# Altium schematic sheet Smartfin Main PCBA Control.SchDoc: Control
size Tabloid; TOCFontName: Consolas; TOCFontSize: 24; TOCFontColor: 0; TOCFontAttributes: 0; TOCMaxLinesInTable: 25; TOCVerticalOffset: 200; TOCHorizontalOffset: 500; TOCHorizontalSeparation: 800; TOCVerticalSeparation: 30; TOCHorizTableSize: 640; Engineer: Amy Domino; DocumentNumber: 644-001-023; Revision: A; SheetNumber: 6; SheetTotal: 9; PageSetup: Record=PageOptions|CenterHorizontal=True|CenterVertical=True|PrintScale=0.96|XCorrection=1.00|YCorrection=1.00|PrintKind=0|BorderSize=5000000|LeftOffset=0|BottomOffset=0|Orientation=2|PaperLength=1000|PaperWidth=1000|Scale=100|PaperSource=7|PrintQuality=-4|MediaType=1|DitherType=10|PaperKind=11" x 17"|PrintScaleMode=1
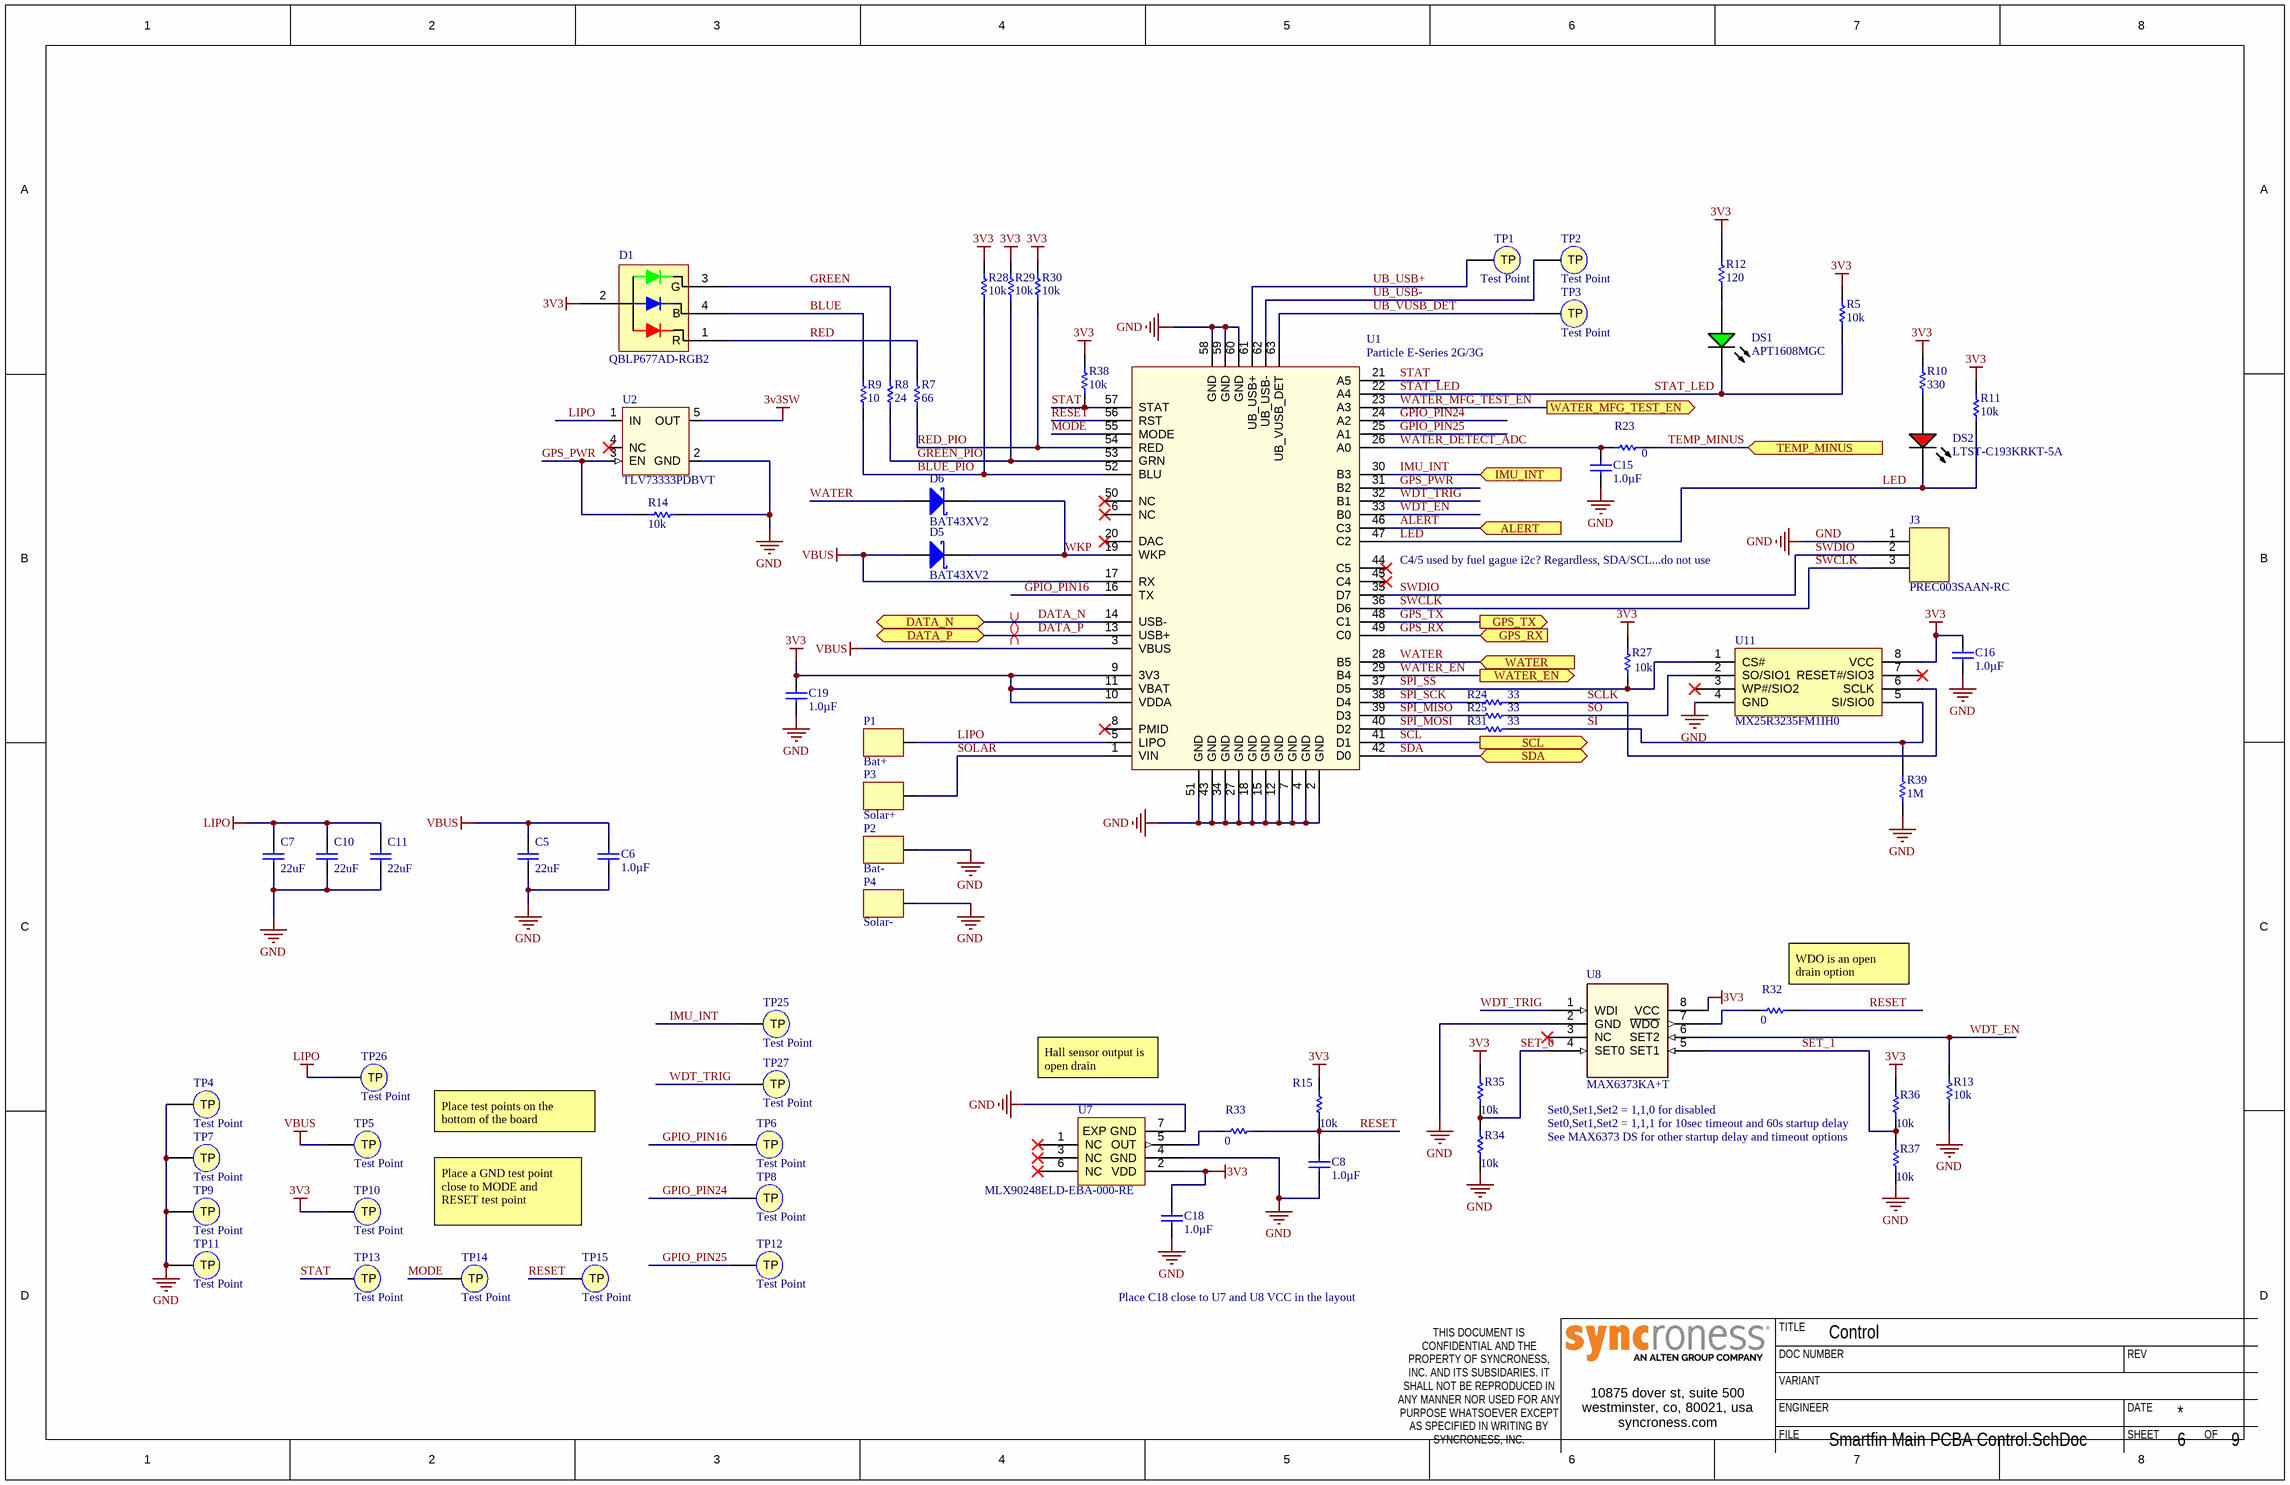
[diagram p0: Smartfin Main PCBA Control.SchDoc]

## Parts
C5  22uF  [CAPC0603(1608)100_N]
C6  1.0µF  [CAPC0402(1005)60_N]
C7  22uF  [CAPC0603(1608)100_N]
C8  1.0µF  [CAPC0402(1005)60_N]
C10  22uF  [CAPC0603(1608)100_N]
C11  22uF  [CAPC0603(1608)100_N]
C15  1.0µF  [CAPC0402(1005)60_N]
C16  1.0µF  [CAPC0402(1005)60_N]
C18  1.0µF  [CAPC0402(1005)60_N]
C19  1.0µF  [CAPC0402(1005)60_N]
D1  QBLP677AD-RGB2  [QBLP677AD-RGB2-Footprint-1]
D5  BAT43XV2  [SOD-523F]
D6  BAT43XV2  [SOD-523F]
DS1  APT1608MGC  [LED1608X08N]
DS2  LTST-C193KRKT-5A  [LTST-C193KRKT-5A_V]
J3  PREC003SAAN-RC  [HDR_Single_100mil_3D_3]
P1  Bat+  [Battery Pad-Footprint-1]  (no BOM)
P2  Bat-  [Battery Pad-Footprint-1]  (no BOM)
P3  Solar+  [Battery Pad-Footprint-1]  (no BOM)
P4  Solar-  [Battery Pad-Footprint-1]  (no BOM)
R5  10k  [RESC0402(1005)_N]
R7  66  [RESC1005X40X25LL05T10]
R8  24  [RESC1005X40X25ML10T10]
R9  10  [RESC1005X40X25ML05T10]
R10  330  [RESC1005X04N]
R11  10k  [RESC0402(1005)_N]
R12  120  [RESC1005X04N]
R13  10k  [RESC0402(1005)_N]
R14  10k  [RESC0402(1005)_N]
R15  10k  [RESC0402(1005)_N]
R23  0  [RESC0402(1005)_N]
R24  33  [RESC1005X04N]
R25  33  [RESC1005X04N]
R27  10k  [RESC0402(1005)_N]
R28  10k  [RESC0402(1005)_N]
R29  10k  [RESC0402(1005)_N]
R30  10k  [RESC0402(1005)_N]
R31  33  [RESC1005X04N]
R32  0  [RESC0402(1005)_N]
R33  0  [RESC0402(1005)_N]
R34  10k  [RESC0402(1005)_N]
R35  10k  [RESC0402(1005)_N]
R36  10k  [RESC0402(1005)_N]
R37  10k  [RESC0402(1005)_N]
R38  10k  [RESC0402(1005)_N]
R39  1M  [RESC0402(1005)_N]
TP1  Test Point  [TESTPAD_ICT]  (no BOM)
TP2  Test Point  [TESTPAD_ICT]  (no BOM)
TP3  Test Point  [TESTPAD_ICT]  (no BOM)
TP4  Test Point  [TESTPAD_ICT]  (no BOM)
TP5  Test Point  [TESTPAD_ICT]  (no BOM)
TP6  Test Point  [TESTPAD_ICT]  (no BOM)
TP7  Test Point  [TESTPAD_ICT]  (no BOM)
TP8  Test Point  [TESTPAD_ICT]  (no BOM)
TP9  Test Point  [TESTPAD_ICT]  (no BOM)
TP10  Test Point  [TESTPAD_ICT]  (no BOM)
TP11  Test Point  [TESTPAD_ICT]  (no BOM)
TP12  Test Point  [TESTPAD_ICT]  (no BOM)
TP13  Test Point  [TESTPAD_ICT]  (no BOM)
TP14  Test Point  [TESTPAD_ICT]  (no BOM)
TP15  Test Point  [TESTPAD_ICT]  (no BOM)
TP25  Test Point  [TESTPAD_ICT]  (no BOM)
TP26  Test Point  [TESTPAD_ICT]  (no BOM)
TP27  Test Point  [TESTPAD_ICT]  (no BOM)
U1  Particle E-Series 2G/3G  [Particle E-Series-Footprint-1]
U2  TLV73333PDBVT  [TLV73333PDBVR-Footprint-1]
U7  MLX90248ELD-EBA-000-RE  [MLX90248ELD-EBA-000-RE-Footprint-1]
U8  MAX6373KA+T  [MAX6373KA+T-Footprint-1]
U11  MX25R3235FM1IH0  [SOP127P600X175-8N]

## Ports
ALERT (in), DATA_N (bidir), DATA_P (bidir), GPS_RX (in), GPS_TX (out), IMU_INT (in), SCL (out), SDA (bidir), TEMP_MINUS (in), WATER (in), WATER_EN (out), WATER_MFG_TEST_EN (out)

## Nets
3V3: C16.2 C18.2 C19.2 D1.2(A) R5.2 R10.2 R11.2 R12.2 R15.2 R27.2 R28.2 R29.2 R30.2 R35.2 R36.2 R38.2 TP10.1(TP) U1.9(3V3) U1.10(VDDA) U1.11(VBAT) U7.2(VDD) U8.8(VCC) U11.8(VCC)
3v3SW: U2.5(OUT)
GND: C5.1 C6.1 C7.1 C8.1 C10.1 C11.1 C15.1 C16.1 C18.1 C19.1 J3.1 P2.1 P4.1 R13.1 R14.1 R34.1 R37.1 R39.1 TP4.1(TP) TP7.1(TP) TP9.1(TP) TP11.1(TP) U1.2(GND) U1.4(GND) U1.7(GND) U1.12(GND) U1.15(GND) U1.18(GND) U1.27(GND) U1.34(GND) U1.43(GND) U1.51(GND) U1.58(GND) U1.59(GND) U1.60(GND) U2.2(GND) U7.4(GND) U7.7(EXP_GND) U8.2(GND) U11.4(GND)
LIPO: C7.2 C10.2 C11.2 P1.1 TP26.1(TP) U1.5(LIPO) U2.1(IN)
VBUS: C5.2 C6.2 D5.A TP5.1(TP) U1.3(VBUS) U1.17(RX)
ALERT: U1.46(C3) ; port ALERT
BLUE: D1.4(B) R9.2
BLUE_PIO: R9.1 R28.1 U1.52(BLU)
DATA_N: U1.14(USB-) ; port DATA_N
DATA_P: U1.13(USB+) ; port DATA_P
GPIO_PIN16: TP6.1(TP) U1.16(TX)
GPIO_PIN24: TP8.1(TP) U1.24(A2)
GPIO_PIN25: TP12.1(TP) U1.25(A1)
GPS_PWR: R14.2 U1.31(B2) U2.3(EN)
GPS_RX: U1.49(C0) ; port GPS_RX
GPS_TX: U1.48(C1) ; port GPS_TX
GREEN: D1.3(G) R8.2
GREEN_PIO: R8.1 R29.1 U1.53(GRN)
IMU_INT: TP25.1(TP) U1.30(B3) ; port IMU_INT
LED: DS2.2(K) R11.1 U1.47(C2)
MODE: TP14.1(TP) U1.55(MODE)
RED: D1.1(R) R7.2
RED_PIO: R7.1 R30.1 U1.54(RED)
RESET: C8.2 R15.1 R32.2 R33.2 TP15.1(TP) U1.56(RST)
SCL: U1.41(D1) ; port SCL
SCLK: R24.2 U11.6(SCLK)
SDA: U1.42(D0) ; port SDA
SET_0: R34.2 R35.1 U8.4(SET0)
SET_1: R36.1 R37.2 U8.5(SET1)
SI: R31.2 R39.2 U11.5(SI/SIO0)
SO: R25.2 U11.2(SO/SIO1)
SOLAR: P3.1 U1.1(VIN)
SPI_MISO: R25.1 U1.39(D3)
SPI_MOSI: R31.1 U1.40(D2)
SPI_SCK: R24.1 U1.38(D4)
SPI_SS: R27.1 U1.37(D5) U11.1(CS#)
STAT: R38.1 TP13.1(TP) U1.21(A5) U1.57(STAT)
STAT_LED: DS1.K R5.1 U1.22(A4)
SWCLK: J3.3 U1.36(D6)
SWDIO: J3.2 U1.35(D7)
TEMP_MINUS: R23.2 ; port TEMP_MINUS
UB_USB+: TP1.1(TP) U1.61(UB_USB+)
UB_USB-: TP2.1(TP) U1.62(UB_USB-)
UB_VUSB_DET: TP3.1(TP) U1.63(UB_VUSB_DET)
WATER: D6.A U1.28(B5) ; port WATER
WATER_DETECT_ADC: C15.2 R23.1 U1.26(A0)
WATER_EN: U1.29(B4) ; port WATER_EN
WATER_MFG_TEST_EN: U1.23(A3) ; port WATER_MFG_TEST_EN
WDT_EN: R13.2 U1.33(B0) U8.6(SET2)
WDT_TRIG: TP27.1(TP) U1.32(B1) U8.1(WDI)
WKP: D5.K D6.K U1.19(WKP)
NetDS1_A: DS1.A R12.1
NetDS2_1: DS2.1(A) R10.1
NetR32_1: R32.1 U8.7(~{WDO})
NetR33_1: R33.1 U7.5(OUT)

Not connected (* = marked no-connect by the designer): U1 6(NC)* 8(PMID)* 20(DAC)* 44(C5)* 45(C4)* 50(NC)*; U2 4(NC)*; U7 1(NC)* 3(NC)* 6(NC)*; U8 3(NC)*; U11 3(WP#/SIO2)* 7(RESET#/SIO3)*

## Layout directives
differential pair: DATA_N, DATA_P

## Notes on the sheet
- (near U1) C4/5 used by fuel gague i2c? Regardless, SDA/SCL...do not use
- (near R32) WDO is an open drain option
- Hall sensor output is open drain
- Place test points on the bottom of the board
- Set0,Set1,Set2 = 1,1,0 for disabled
- (near R37) See MAX6373 DS for other startup delay and timeout options
- (near R36) Set0,Set1,Set2 = 1,1,1 for 10sec timeout and 60s startup delay
- Place a GND test point close to MODE and RESET test point
- Place C18 close to U7 and U8 VCC in the layout
- TITLE
- DOC NUMBER
- VARIANT
- REV
- 10875 dover st, suite 500
  westminster, co, 80021, usa
  syncroness.com
- FILE
- ENGINEER
- SHEET
- DATE
- OF
- THIS DOCUMENT IS CONFIDENTIAL AND THE PROPERTY OF SYNCRONESS, INC. AND ITS SUBSIDARIES. IT SHALL NOT BE REPRODUCED IN ANY MANNER NOR USED FOR ANY PURPOSE WHATSOEVER EXCEPT AS SPECIFIED IN WRITING BY SYNCRONESS, INC.

## Library data of the parts
C5 C7 C10 C11 = CMP-23693-A.2: CAP CER 22UF 10V X5R 0603; Manufacturer: Murata Electronics; Manufacturer Part Number: GRM188R61A226ME15D; Tolerance: 20%; Case/Package: 0603; Case Code (Metric): 1608; Case Code (Imperial): 0603; Capacitance: 22uF; Voltage Rating: 10V; Dielectric: X5R; Height: 1mm; Width: 0.8mm; Manufacturer 2: Samsung Electro-Mechanics; Manufacturer 3: TDK Corporation; Manufacturer Part Number 2: CL10A226MPCNUBE; Manufacturer Part Number 3: C1608X5R1A226M080AC; Operating Temperature: -55°C ~ 85°C; Supplier 1: Digi-Key; Supplier 2: Digi-Key; Supplier 3: Digi-Key; Supplier Part Number 1: 490-10476-1-ND; Supplier Part Number 2: 1276-6504-1-ND; Supplier Part Number 3: 445-9077-1-ND
C6 C8 C15 C16 C18 C19 = CMP-13694-A.6: CAP CER 1UF 10V 10% X5R 0402; Manufacturer: Yageo; Manufacturer Part Number: CC0402KRX5R6BB105; Manufacturer 2: Samsung Electro-Mechanics; Manufacturer 3: AVX Corporation; Manufacturer Part Number 2: CL05A105KP5NNNC; Manufacturer Part Number 3: 0402ZD105KAT2A; Operating Temperature: -55°C ~ 85°C; Supplier Part Number 1: 311-1439-1-ND; Supplier Part Number 2: 1276-1076-1-ND; Supplier Part Number 3: 478-4596-1-ND; Temperature Coefficient: X5R; Tolerance: ±10%; Capacitance: 1.0µF; Voltage - Rated: 10V; Supplier 2: Digi-Key; Supplier 3: Digi-Key; Supplier 1: Digi-Key; Datasheet: http://www.samsungsem.com/kr/support/product-search/mlcc/__icsFiles/afieldfile/2019/05/10/19-CL05A105KP5NNNC.pdf
D1 = CMP-23886-A.1: LED RGB, 3528 PLCC4 DOME LENS, 2; Manufacturer: QT Brightek (QTB); Color: Blue,Green,Red; Lens Style: Round,Dome; Element Configuration: Common Anode; Lens Transparency: Diffused; Test Current: 20mA; Viewing Angle: 30°; Lens Size: 2.40mm; Mount: Surface Mount; Case/Package: SMD/SMT; Length: 3.20mm; Height: 3.30mm; Width: 2.7mm; Manufacturer Part Number: QBLP677AD-RGB2; Supplier: Digi-Key; Supplier Part Number: 1516-QBLP677AD-RGB2CT-ND
D5 D6 = CMP-23830-A.2: DIODE SCHOTTKY 30V 200MA SOD523F; Manufacturer: ON Semiconductor; Max Surge Current: 4A; Max Power Dissipation: 200mW; Recovery Time: 5ns; Forward Voltage: 1V; Max Reverse Leakage Current: 500nA; Peak Reverse Current: 10mA; Element Configuration: Single; Manufacturer Part Number: BAT43XV2; Packaging: Tape and Reel; Mount: Surface Mount; Number of Pins: 2; Weight: 0.01g; Contact Plating: Tin,Matte; Min Operating Temperature: -65°C; Max Operating Temperature: 125°C; Package Quantity: 1; Forward Current: 200mA; Average Rectified Current: 200mA; Reverse Recovery Time: 5ns; Max Repetitive Reverse Voltage (Vrrm): 30V; Peak Non-Repetitive Surge Current: 4A; Max Forward Surge Current (Ifsm): 200mA; Max Reverse Voltage (DC): 30V; Length: 1.3mm; Height: 0.7mm; Width: 0.9mm; Radiation Hardening: No; Supplier: Digi-Key; Supplier Part Number: BAT43XV2CT-ND
DS1 = CMP-08086-A.3: LED 1.6X0.8MM 570NM GRN CLR SMD; Manufacturer: Kingbright; Color: Green; Current - Test: 20mA; Lens Style/Size: Rectangle with Flat Top, 1.2mm x 0.8mm; Lens Type: Clear; Millicandela Rating: 70mcd; Viewing Angle: 120°; Voltage - Forward (Vf) (Typ): 2.1V; Wavelength - Peak: 574nm; Manufacturer Part Number: APT1608MGC; ComponentLink1URL: http://www.kingbrightusa.com/images/catalog/SPEC/APT1608MGC.pdf; Height: 0.75mm; Mounting Type: Surface Mount; Package / Case: 0603 (1608 Metric); Packaging: Cut Tape (CT); Pricing: 0.62; RoHS: RoHS Compliant; Size / Dimension: 1.60mm L x 0.80mm W; Stock: 19251; Supplier Part Number 1: 754-1118-1-ND; Wavelength - Dominant: 570nm; Category: Optoelectronics; ComponentLink1Description: Datasheet; Luminous Flux @ Current - Test: -; Supplier 1: Digi-Key
DS2 = CMP-23696-A.2: LED RED CLEAR CHIP SMD 0603; Manufacturer: Lite-On Inc.; Viewing Angle: 130°; Lens Style: Diffused,Colorless,Clear,Rectangular; Luminous Intensity: 45mcd; Forward Current: 5mA; Forward Voltage: 2.3V; Dominant Wavelength: 631nm; Power Dissipation: 50mW; Reverse Voltage: 5V; Case/Package: 0603; Color: Red; Test Current: 5mA; Height: 0.45mm; Datasheet: http://optoelectronics.liteon.com/upload/download/DS22-2005-077/LTST-C193KRKT-5A.PDF; Manufacturer Part Number: LTST-C193KRKT-5A; Operating Temperature: -55°C ~ 85°C; Supplier: Digi-Key; Supplier Part Number: 160-1830-1-ND
J3 = CMP-09249-5: CONN HEADER .100" SNGL STR 3POS; Manufacturer: Sullins Connector Solutions; Connector Type: Header, Unshrouded; Number of Positions: 3; Number of Positions Loaded: All; Pitch: 0.100" (2.54mm); SchLibComponentName: PREC003SAAN-RC; Manufacturer Part Number: PREC003SAAN-RC; RoHS: RoHS Compliant; Category: Connectors, Interconnects; Packaging: Bulk; Contact Type: Male Pin; Number of Rows: 1; Contact Mating Length: 0.230" (5.84mm); Mounting Type: Through Hole; Termination: Solder; Fastening Type: -; Features: -; Contact Finish: Tin; Contact Finish Thickness: -; Color: Black; ComponentLink1URL: http://media.digikey.com/PDF/Data%20Sheets/Sullins%20PDFs/z%20RzCzzzSzzN-RC,%20ST,11635-B.pdf; ComponentLink1Description: http://media.digikey.com/PDF/Data%20Sheets/Sullins%20PDFs/z%20RzCzzzSzzN-RC,%20ST,11635-B.pdf; Supplier Part Number: S1012EC-03-ND; Supplier: Digi-Key
P1-P4 = CMP-23776-A.3: Battery Pad for Smartfin Main board
R5 R11 R13-R15 R27-R30 R34-R38 = CMP-15831-A.1: RES SMD 10K OHM 0.1% 1/16W 0402; Manufacturer: Panasonic Electronic Components; Manufacturer Part Number: ERA-2ARB103X; Power (Watts): 0.063W, 1/16W; Temperature Coefficient: ±10ppm/°C; Packaging: Cut Tape (CT); Part Status: Active; Resistance (Ohms): 10k; Tolerance: ±0.1%; Composition: Thin Film; Features: Automotive AEC-Q200; Operating Temperature: -55°C ~ 155°C; Package / Case: 0402 (1005 Metric); Supplier Device Package: 0402; Size / Dimension: 0.039" L x 0.020" W (1.00mm x 0.50mm); Height - Seated (Max): 0.016" (0.40mm); Failure Rate: -; Supplier: Digi-Key; Supplier Part Number: P10KCPCT-ND; ComponentLink1Description: Datasheet; ComponentLink1URL: https://industrial.panasonic.com/cdbs/www-data/pdf/RDM0000/AOA0000C237.pdf
R7 = CMP-2002-07771-1: Res Thick Film 0402 66.5 Ohm 1% 1/16W ±100ppm/°C Molded SMD Paper T/R; Part Number: RC0402FR-0766R5L; Manufacturer: Yageo; Additional Feature: LASER TRIMMABLE; Rated Power Dissipation (P): 62.5mW; Rated Temperature: 70°C; Resistance: 66.5R; Working Voltage: 50V; Package Height: 0.35mm; Package Length: 1mm; Package Width: 0.5mm; Supplier 1: Digi-Key; Supplier Part Number 1: YAG3210CT-ND; Manufacturer Part Number: RC0402FR-0766R5L; RoHS: Yes; Category: Chip SMD Resistors; Stock 1: 25875; Pricing 1: 1=0.10000, 10=0.01600, 100=0.00660, 1000=0.00299, 2500=0.00259, 5000=0.00214 (USD); Mount: Surface Mount; Number of Pins: 2; Package Shape: Rectangular; Size Code: 0402; Terminal Finish: Nickel; Min Operating Temperature: -55°C; Max Operating Temperature: 155°C; Tolerance: 1%; JESD-609 Code: e3; Resistor Type: FIXED RESISTOR; Construction: Chip; Package Style: SMTMeter; Packaging: Tape and Reel; Technology: METAL GLAZE/THICK FILM; Temperature Coefficient: 100ppm/°C; Termination: Wraparound; REACH SVHC: Yes; RoHS Compliant: Yes; ComponentLink1URL: https://datasheet.ciiva.com:443/pdfs/VipMasterIC/IC/YAGO/YAGO-S-A0008145938/YAGO-S-A0008145938-1.pdf?src-supplier=IHS+Markit; ComponentLink1Description: https://datasheet.ciiva.com:443/pdfs/VipMasterIC/IC/YAGO/YAGO-S-A0008145938/YAGO-S-A0008145938-1.pdf?src-supplier=IHS+Markit; ComponentLink2URL: https://datasheet.ciiva.com/8888/pyu-rc0402-51-rohs-l-6-8888441.pdf?src-supplier=Avnet; ComponentLink2Description: https://datasheet.ciiva.com/8888/pyu-rc0402-51-rohs-l-6-8888441.pdf?src-supplier=Avnet; ComponentLink3URL: https://datasheet.ciiva.com/28397/pyu-rc0402-51-rohs-l-6-28397577.pdf?src-supplier=Avnet+Europe; ComponentLink3Description: https://datasheet.ciiva.com/28397/pyu-rc0402-51-rohs-l-6-28397577.pdf?src-supplier=Avnet+Europe; ComponentLink4URL: https://datasheet.ciiva.com/16867/pyu-rc0402-51-rohs-l-6-16867534.pdf?src-supplier=Avnet+Europe; ComponentLink4Description: https://datasheet.ciiva.com/16867/pyu-rc0402-51-rohs-l-6-16867534.pdf?src-supplier=Avnet+Europe
R8 = CMP-2002-05717-1: Fixed Resistor, Metal Glaze/thick Film, 0.063W, 24ohm, 50V, 1% +/-Tol, 100ppm/Cel, Surface Mount, 0402; Manufacturer: TE Connectivity / AMP; Part Number: CRG0402F24R; Rated Power Dissipation (P): 63mW; Rated Temperature: 70°C; Resistance: 24R; Temperature Coefficient: 100ppm/°C; Additional Feature: LASER TRIMMABLE; Package Height: 0.35mm; Package Length: 1mm; Package Width: 0.5mm; Supplier 1: Newark; Supplier Part Number 1: 42AJ6992; Manufacturer Part Number: CRG0402F24R; RoHS: Yes; Category: Chip SMD Resistors; Stock 1: 80000; Pricing 1: 10000=0.00300 (USD); Mount: Surface Mount; Number of Pins: 2; Package Shape: Rectangular; Size Code: 0402; Min Operating Temperature: -55°C; Max Operating Temperature: 125°C; Tolerance: 1%; Resistor Type: FIXED RESISTOR; Packaging: Tape and Reel; Technology: METAL GLAZE/THICK FILM; Termination: Wraparound; Working Voltage: 50V; Construction: Rectangular; Package Style: SMTMeter; REACH SVHC: Yes; RoHS Compliant: Yes; ComponentLink1URL: https://www.te.com:443/usa-en/product-8-1622826-0.datasheet.pdf?src-supplier=IHS+Markit; ComponentLink1Description: https://www.te.com:443/usa-en/product-8-1622826-0.datasheet.pdf?src-supplier=IHS+Markit; ComponentLink2URL: https://datasheet.ciiva.com/22706/1610603-22706087.pdf?src-supplier=Element14; ComponentLink2Description: https://datasheet.ciiva.com/22706/1610603-22706087.pdf?src-supplier=Element14; ComponentLink3URL: https://datasheet.ciiva.com/12574/eng-ds-1773204-g-12574725.pdf?src-supplier=Mouser; ComponentLink3Description: https://datasheet.ciiva.com/12574/eng-ds-1773204-g-12574725.pdf?src-supplier=Mouser
R9 = CMP-2002-07358-1: Fixed Resistor, Metal Glaze/thick Film, 0.0625W, 10ohm, 50V, 1% +/-Tol, 200ppm/Cel, Surface Mount, 0402; Manufacturer: Yageo / Phycomp; Part Number: RC0402FR-0710RL; Additional Feature: LASER TRIMMABLE; Rated Power Dissipation (P): 62.5mW; Rated Temperature: 70°C; Resistance: 10R; Temperature Coefficient: 200ppm/°C; Package Height: 0.35mm; Package Length: 1mm; Package Width: 0.5mm; Supplier 1: Digi-Key; Supplier Part Number 1: 311-10.0LRCT-ND; Manufacturer Part Number: RC0402FR-0710RL; RoHS: Yes; Category: Chip SMD Resistors; Stock 1: 2132757; Pricing 1: 1=0.10000, 10=0.02500, 100=0.01000, 1000=0.00451, 2500=0.00392, 5000=0.00323 (USD); Mount: Surface Mount; Number of Pins: 2; Package Shape: Rectangular; Size Code: 0402; Terminal Finish: Nickel; Min Operating Temperature: -55°C; Max Operating Temperature: 155°C; Tolerance: 1%; JESD-609 Code: e3; Resistor Type: FIXED RESISTOR; Construction: Chip; Package Style: SMTMeter; Packaging: Tape and Reel; Technology: METAL GLAZE/THICK FILM; Termination: Wraparound; Working Voltage: 50V; REACH SVHC: Yes; RoHS Compliant: Yes; ComponentLink1URL: https://datasheet.ciiva.com:443/pdfs/VipMasterIC/IC/YAGO/YAGO-S-A0008145938/YAGO-S-A0008145938-1.pdf?src-supplier=IHS+Markit; ComponentLink1Description: https://datasheet.ciiva.com:443/pdfs/VipMasterIC/IC/YAGO/YAGO-S-A0008145938/YAGO-S-A0008145938-1.pdf?src-supplier=IHS+Markit; ComponentLink2URL: https://datasheet.ciiva.com/11808/0900766b80c66297-11808764.pdf?src-supplier=RSComponents; ComponentLink2Description: https://datasheet.ciiva.com/11808/0900766b80c66297-11808764.pdf?src-supplier=RSComponents; ComponentLink3URL: https://datasheet.ciiva.com/46394/1018594-46394954.pdf?src-supplier=Element14; ComponentLink3Description: https://datasheet.ciiva.com/46394/1018594-46394954.pdf?src-supplier=Element14; ComponentLink4URL: https://datasheet.ciiva.com/7849/1018594-7849818.pdf?src-supplier=Element14; ComponentLink4Description: https://datasheet.ciiva.com/7849/1018594-7849818.pdf?src-supplier=Element14; ComponentLink5URL: https://datasheet.ciiva.com/7849/1018594-7849819.pdf?src-supplier=Element14; ComponentLink5Description: https://datasheet.ciiva.com/7849/1018594-7849819.pdf?src-supplier=Element14; ComponentLink6URL: https://datasheet.ciiva.com/15189/getdatasheetpartid-323697-15189339.pdf?src-supplier=Verical; ComponentLink6Description: https://datasheet.ciiva.com/15189/getdatasheetpartid-323697-15189339.pdf?src-supplier=Verical
R10 = CMP-22585-A.1: RES SMD 330 OHM 1% 1/16W 0402; Manufacturer: Vishay Dale; Manufacturer Part Number: CRCW0402330RFKED; Power (Watts): 0.063W, 1/16W; Temperature Coefficient: ±100ppm/°C; Resistance: 330 Ohms; ComponentLink1Description: Datasheet; ComponentLink1URL: http://www.vishay.com/docs/20035/dcrcwe3.pdf; Composition: Thick Film; Features: AEC-Q200; Height - Seated (Max): 0.016" (0.40mm); Operating Temperature: -55°C ~ 155°C; Package / Case: 0402 (1005 Metric); Size / Dimension: 0.039" L x 0.020" W (1.00mm x 0.50mm); Supplier: Digi-Key; Supplier Part Number: 541-330LCT-ND; Tolerance: ±1%
R12 = CMP-20572-A.1: RES SMD 120 OHM 5% 1/16W 0402; Manufacturer: Vishay Dale; Manufacturer Part Number: CRCW0402120RJNED; Power (Watts): 0.063W, 1/16W; Resistance: 120 Ohms; Temperature Coefficient: ±200ppm/°C; ComponentLink1Description: Datasheet; ComponentLink1URL: http://www.vishay.com/docs/20035/dcrcwe3.pdf; Composition: Thick Film; Features: AEC-Q200; Height - Seated (Max): 0.016" (0.40mm); Operating Temperature: -55°C ~ 155°C; Package / Case: 0402 (1005 Metric); Packaging: Cut Tape (CT); Part Status: Active; Size / Dimension: 0.039" L x 0.020" W (1.00mm x 0.50mm); Supplier: Digi-Key; Supplier Part Number: 541-120JCT-ND; Tolerance: ±5%
R23 R32 R33 = CMP-10566-A.1: RES 0.0 OHM 1/16W 0402 SMD; Manufacturer: Vishay/Dale; Manufacturer Part Number: CRCW04020000Z0ED; Temperature Coefficient: ±100ppm/°C; Tolerance: 5%; Wattage: 1/16 W; Composition: Thick Film; Supplier 1: Digikey; Supplier 4: Digikey; Supplier 2: Digikey; Supplier 3: Digikey; Supplier 5: Digikey; Manufacturer 2: Rohm Semiconductor; Manufacturer 3: Yageo; Manufacturer 4: Stackpole Electronics Inc; Manufacturer Part Number 2: MCR01MRTJ000; Manufacturer Part Number 3: RC0402JR-070RL; Manufacturer Part Number 4: RMCF0402ZT0R00; Resistance: 0; Supplier Part Number 1: 541-0.0JCT-ND; Supplier Part Number 2: RHM0.0CECT-ND; Supplier Part Number 3: 311-0.0JRCT-ND; Supplier Part Number 4: RMCF0402ZT0R00CT-ND
R24 R25 R31 = CMP-20566-A.1: RES SMD 33 OHM 5% 1/16W 0402; Manufacturer: Vishay Dale; Manufacturer Part Number: CRCW040233R0JNED; Power (Watts): 0.063W, 1/16W; Resistance: 33 Ohms; Temperature Coefficient: ±200ppm/°C; ComponentLink1Description: Datasheet; ComponentLink1URL: http://www.vishay.com/docs/20035/dcrcwe3.pdf; Composition: Thick Film; Features: AEC-Q200; Height - Seated (Max): 0.016" (0.40mm); Operating Temperature: -55°C ~ 155°C; Package / Case: 0402 (1005 Metric); Packaging: Cut Tape (CT); Part Status: Active; Size / Dimension: 0.039" L x 0.020" W (1.00mm x 0.50mm); Supplier: Digi-Key; Supplier Part Number: 541-33JCT-ND; Tolerance: ±5%
R39 = CMP-10629-A.1: RES 1.0M OHM 1/16W 5% 0402 SMD; Manufacturer Part Number: RC0402JR-071ML; Manufacturer: Yageo; Temperature Coefficient: ±100ppm/°C; Manufacturer Part Number 2: RMCF0402JT1M00; Resistance: 1M; Supplier Part Number 1: 311-1.0MJRCT-ND; Supplier Part Number 2: RMCF0402JT1M00CT-ND; Tolerance: 5%; Wattage: 1/16 W; Composition: Thick Film; Supplier 1: Digikey; Supplier 4: Digikey; Supplier 2: Digikey; Supplier 3: Digikey; Supplier 5: Digikey; Manufacturer 2: Stackpole Electronics Inc
TP1-TP15 TP25-TP27 = CMP-08242-A.3: ICT Test Point
U1 = CMP-23710-A.5: Global 2G/3G, U-blox SARA-U201 Modem; Manufacturer Part Number: E310; Manufacturer: Particle; Supplier: Particle; Datasheet: https://docs.particle.io/datasheets/cellular/e-series-datasheet/; Supplier Part Number: E310MOD1
U2 = CMP-23694-A.8: IC REG LINEAR 3.3V 300MA SOT23-5; Manufacturer: Texas Instruments; Number of Outputs: 1; Min Input Voltage: 1.4V; Max Input Voltage: 5.5V; Dropout Voltage: 125mV; Min Current Limit: 360mA; Polarity: Positive; Quiescent Current: 60uA; Accuracy: 1%; Output Type: Fixed; Mount: Surface Mount; Case/Package: SOT-23-5; Number of Pins: 5; Weight: 0.000557oz; Contact Plating: Gold; Min Operating Temperature: -40°C; Max Operating Temperature: 125°C; Packaging: Tape and Reel; Max Output Current: 300mA; Output Voltage: 3.3V; Output Current: 300mA; Number of Regulators: 1; Package Quantity: 3000; Radiation Hardening: No; Lead Free: Lead Free; Manufacturer Part Number: TLV73333PDBVT; Supplier: Digi-Key; Supplier Part Number: 296-40673-1-ND; ComponentLink1Description: datasheet; ComponentLink1URL: vhttps://www.ti.com/lit/ds/symlink/tlv733p.pdf
U7 = CMP-23697-A.7: MAGNETIC SWITCH OMNIPOLAR 6UTQFN; Manufacturer: Melexis; Max Supply Current: 10uA; Max Output Current: 10mA; Sensing Method: Hall Effect; Number of Pins: 6; Min Operating Temperature: -40°C; Max Operating Temperature: 85°C; Packaging: Bulk; Lead Free: Lead Free; Manufacturer Part Number: MLX90248ELD-EBA-000-RE; Supplier: Digi-Key; Supplier Part Number: MLX90248ELD-EBA-000-RECT-ND
U8 = CMP-23704-A.5: IC WATCHDOG TIMER SOT23-8; Manufacturer: Maxim Integrated; Max Power Dissipation: 700mW; Operating Supply Current: 10uA; Frequency: 33kHz; Max Supply Voltage: 5.5V; Min Supply Voltage: 2.5V; Case/Package: SOT-23; Height: 1.3mm; Datasheet: https://datasheets.maximintegrated.com/en/ds/MAX6369-MAX6374.pdf; Manufacturer Part Number: MAX6373KA+T; Operating Temperature: -40°C ~ 125°C; Supplier: Digi-Key; Supplier Part Number: MAX6373KA+TCT-ND
U11 = CMP-23702-A.4: IC FLASH 32M SPI 80MHZ 8SOP; Manufacturer: Macronix; Memory Type: FLASH,NOR; Interface: SPI,Serial; Case/Package: SOIC; Min Operating Temperature: -40°C; Max Operating Temperature: 85°C; Packaging: Rail/Tube; Frequency: 80MHz; Lead Free: Lead Free; Manufacturer Part Number: MX25R3235FM1IH0; Supplier: Digi-Key; Supplier Part Number: 1092-1175-ND